# Altium schematic sheet RFHeader.SchDoc
size A4; SheetNumber: 8; SheetTotal: 13
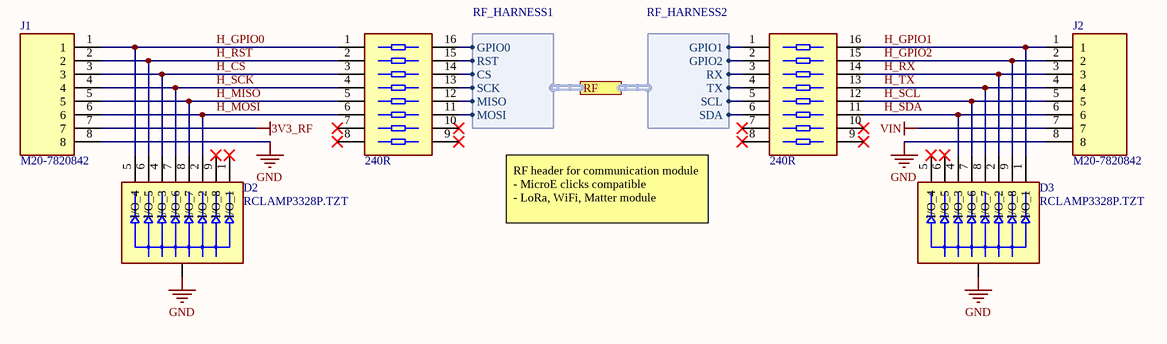
[diagram p0: RFHeader.SchDoc]

## Parts
D2  RCLAMP3328P.TZT  [RCLAMP3328PTZT]
D3  RCLAMP3328P.TZT  [RCLAMP3328PTZT]
J1  M20-7820842  [RHDR8W80P0X254_1X8_2032X254X850P]
J2  M20-7820842  [RHDR8W80P0X254_1X8_2032X254X850P]
RN1  240R  [EXBU2H]
RN2  240R  [EXBU2H]

## Ports
RF (harness RF_HARNESS1, see main[3C], MCU[3C])

## Harnesses
RF_HARNESS1: GPIO0, RST, CS, SCK, MISO, MOSI
RF_HARNESS2: GPIO1, GPIO2, TX, RX, SCL, SDA

## Nets
3V3_RF: J1.7
GND: D2.3(GND) D3.3(GND) J1.8 J2.8
VIN: J2.7
H_CS: D2.4(I/O_3) J1.3 RN1.3
H_GPIO0: D2.5(I/O_4) J1.1 RN1.1
H_GPIO1: D3.1(I/O_1) J2.1 RN2.16
H_GPIO2: D3.9(I/O_8) J2.2 RN2.15
H_MISO: D2.8(I/O_7) J1.5 RN1.5
H_MOSI: D2.2(I/O_2) J1.6 RN1.6
H_RST: D2.6(I/O_5) J1.2 RN1.2
H_RX: D3.2(I/O_2) J2.3 RN2.14
H_SCK: D2.7(I/O_6) J1.4 RN1.4
H_SCL: D3.7(I/O_6) J2.5 RN2.12
H_SDA: D3.4(I/O_3) J2.6 RN2.11
H_TX: D3.8(I/O_7) J2.4 RN2.13
NetRN1_11: RN1.11 ; port RF.MOSI
NetRN1_12: RN1.12 ; port RF.MISO
NetRN1_13: RN1.13 ; port RF.SCK
NetRN1_14: RN1.14 ; port RF.CS
NetRN1_15: RN1.15 ; port RF.RST
NetRN1_16: RN1.16 ; port RF.GPIO0
NetRN2_1: RN2.1 ; port RF.GPIO1
NetRN2_2: RN2.2 ; port RF.GPIO2
NetRN2_3: RN2.3 ; port RF.RX
NetRN2_4: RN2.4 ; port RF.TX
NetRN2_5: RN2.5 ; port RF.SCL
NetRN2_6: RN2.6 ; port RF.SDA

Not connected (* = marked no-connect by the designer): D2 1(I/O_1)* 9(I/O_8)*; D3 5(I/O_4)* 6(I/O_5)*; RN1 7* 8* 9* 10*; RN2 7* 8* 9* 10*

## Notes on the sheet
- RF header for communication module
  - MicroE clicks compatible
  - LoRa, WiFi, Matter module
- Title:
- Date:
- Project:
- Type:
- Schematic
- Variant:
- Revision:
- Sheet
- of
- Author:
- Evžen Šteif
- Size:
- A4

## Library data of the parts
D2 D3 = RCLAMP3328P.TZT: TVS Diode (Uni-directional); Manufacturer_Name: SEMTECH; Datasheet Link: https://media.digikey.com/pdf/Data%20Sheets/Semtech%20PDFs/RCLAMP3328P.pdf; Height: 0.525mm; Manufacturer_Part_Number: RCLAMP3328P.TZT; Mouser Part Number: 947-RCLAMP3328P.TZT; Mouser Price/Stock: https://www.mouser.co.uk/ProductDetail/Semtech/RCLAMP3328P.TZT?qs=rBWM4%252BvDhIeqoxUfuQEPWg%3D%3D; Arrow Part Number: RCLAMP3328P.TZT; Arrow Price/Stock: https://www.arrow.com/en/products/rclamp3328p.tzt/semtech?utm_currency=USD&region=europe
J1 J2 = M20-7820842: Connector; Manufacturer_Name: Harwin; Datasheet Link: https://cdn.harwin.com/pdfs/M20-782.pdf; Height: 8.5mm; Manufacturer_Part_Number: M20-7820842; Mouser Part Number: 855-M20-7820842; Mouser Price/Stock: https://www.mouser.co.uk/ProductDetail/Harwin/M20-7820842?qs=WS5Jv%252B%252Bx1qXOep0XOTvy2Q%3D%3D; System: Connector
RN1 RN2 = EXB-U2H102JV: Resistor Network (16-Pin); Manufacturer_Name: Panasonic; Datasheet Link: https://industrial.panasonic.com/cdbs/www-data/pdf/AOC0000/AOC0000C20.pdf; Height: 0.55mm; Manufacturer_Part_Number: EXB-U2H102JV; Mouser Part Number: 667-EXB-U2H102JV; Mouser Price/Stock: https://www.mouser.co.uk/ProductDetail/Panasonic/EXB-U2H102JV?qs=Z3CaLxJiOJIxUASPpxcvBQ%3D%3D; Arrow Part Number: EXB-U2H102JV; Arrow Price/Stock: null?region=nac